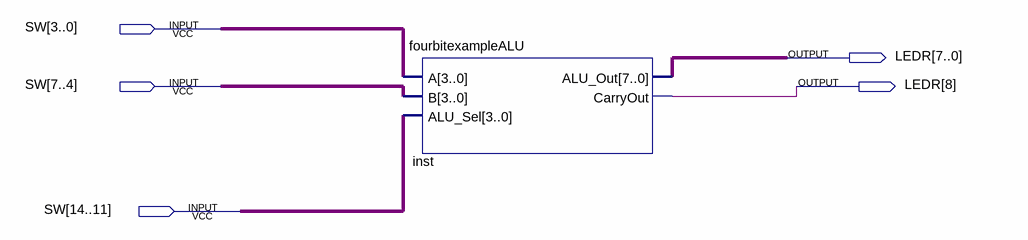
[diagram p0: schematic sheet]
// Quartus schematic blockdiagram.bdf as structural Verilog: 1 symbols, 5 pins
module blockdiagram (
  input  [14:0] SW,
  output [8:0] LEDR
);

  fourbitexampleALU inst (.A(SW[3:0]), .B(SW[7:4]), .ALU_Sel(SW[14:11]), .ALU_Out(LEDR[7:0]), .CarryOut(LEDR[8]));
endmodule
